# EAGLE design d_main2 (EAGLE 7.2.0)
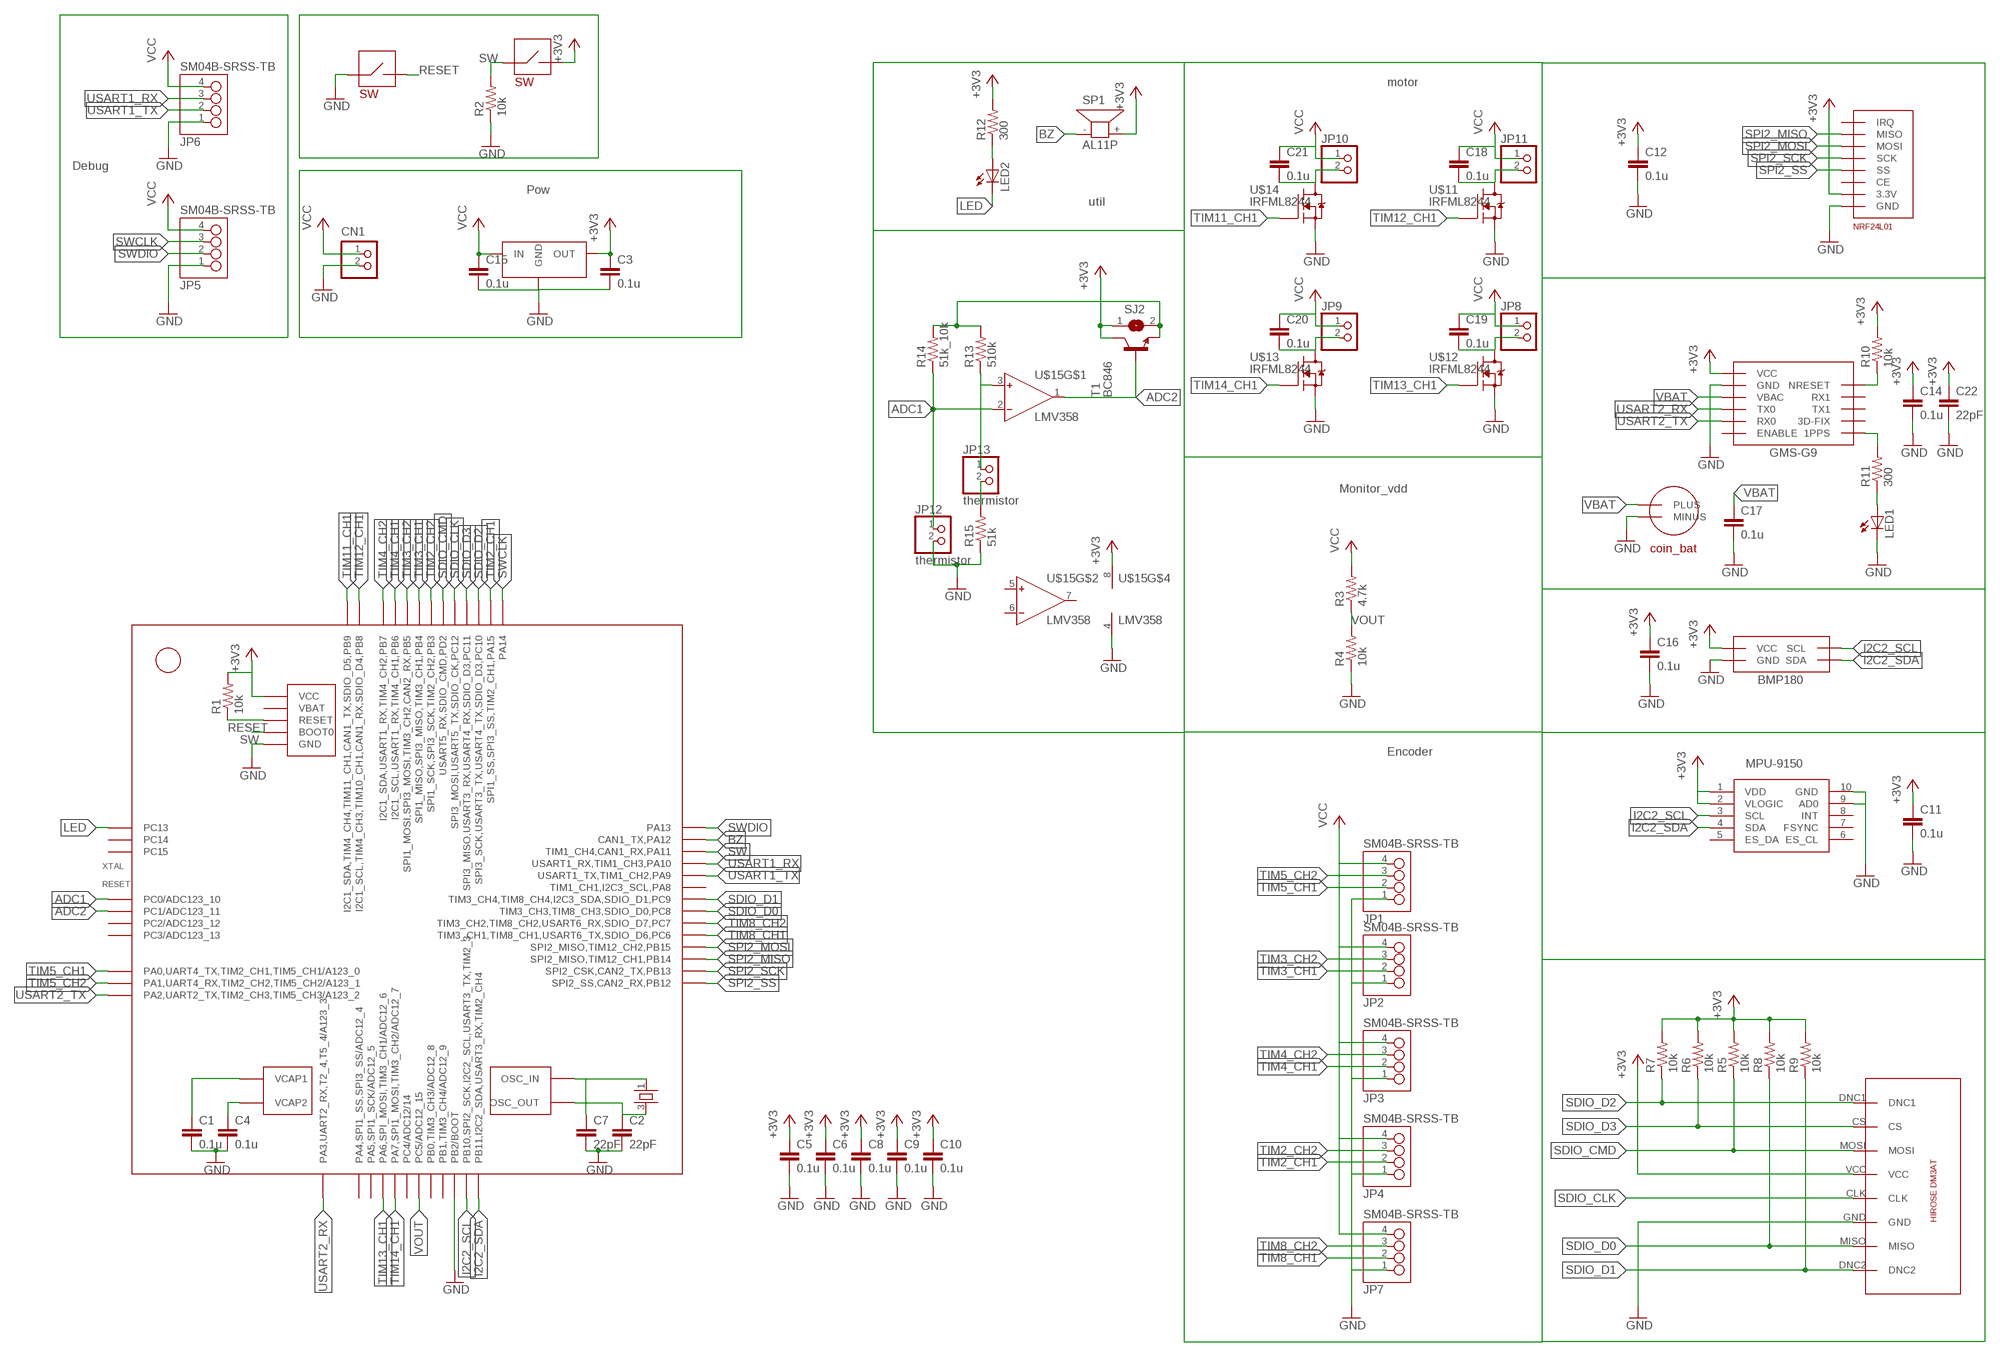
[diagram p0: schematic, sheet 1, part 1 of 2]
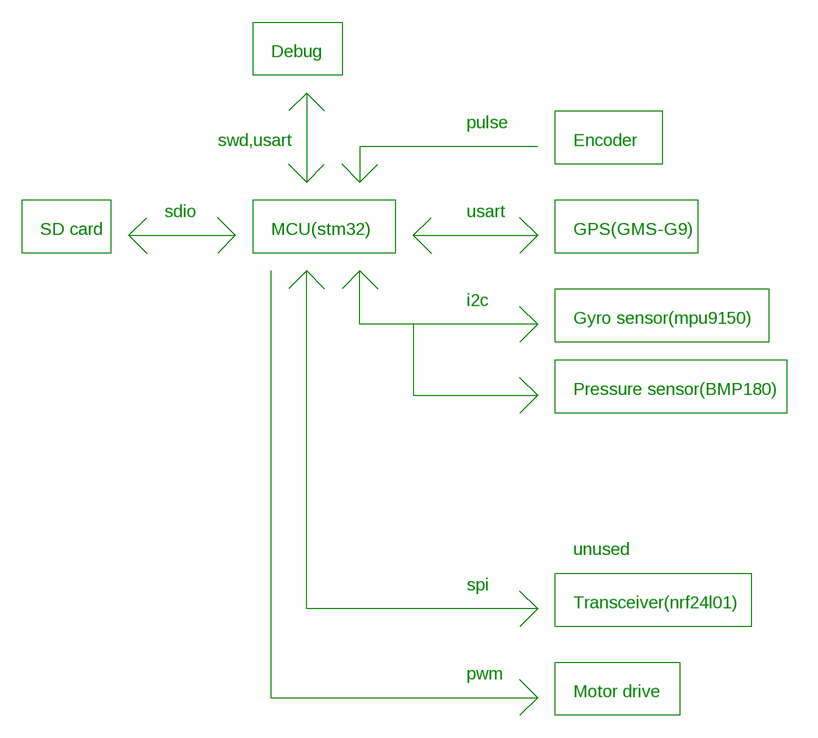
[diagram p1: schematic, sheet 1, part 2 of 2]

## Parts
C1  0.1u  C-EUC0603K  [C0603K]
C2  22pF  C-EUC0603K  [C0603K]
C3  0.1u  C-EUC0603K  [C0603K]
C4  0.1u  C-EUC0603K  [C0603K]
C5  0.1u  C-EUC0603K  [C0603K]
C6  0.1u  C-EUC0603K  [C0603K]
C7  22pF  C-EUC0603K  [C0603K]
C8  0.1u  C-EUC0603K  [C0603K]
C9  0.1u  C-EUC0603K  [C0603K]
C10  0.1u  C-EUC0603K  [C0603K]
C11  0.1u  C-EUC0603K  [C0603K]
C12  0.1u  C-EUC0603K  [C0603K]
C14  0.1u  C-EUC0603K  [C0603K]
C15  0.1u  C-EUC0603K  [C0603K]
C16  0.1u  C-EUC0603K  [C0603K]
C17  0.1u  C-EUC0603K  [C0603K]
C18  0.1u  C-EUC0603K  [C0603K]
C19  0.1u  C-EUC0603K  [C0603K]
C20  0.1u  C-EUC0603K  [C0603K]
C21  0.1u  C-EUC0603K  [C0603K]
C22  22pF  C-EUC0603K  [C0603K]
CN1  S2B-XASK-1  [S2B-XASK-1]
JP1  SM04B-SRSS-TB  [SM04B-SRSS-TB]
JP2  SM04B-SRSS-TB  [SM04B-SRSS-TB]
JP3  SM04B-SRSS-TB  [SM04B-SRSS-TB]
JP4  SM04B-SRSS-TB  [SM04B-SRSS-TB]
JP5  SM04B-SRSS-TB  [SM04B-SRSS-TB]
JP6  SM04B-SRSS-TB  [SM04B-SRSS-TB]
JP7  SM04B-SRSS-TB  [SM04B-SRSS-TB]
JP8  PINHD-1X2  [1X02]
JP9  PINHD-1X2  [1X02]
JP10  PINHD-1X2  [1X02]
JP11  PINHD-1X2  [1X02]
JP12  thermistor  PINHD-1X2  [1X02]
JP13  thermistor  PINHD-1X2  [1X02]
LED1  LEDCHIP-LED0603  [CHIP-LED0603]
LED2  LEDCHIP-LED0603  [CHIP-LED0603]
R1  10k  R-US_R0603  [R0603]
R2  10k  R-US_R0603  [R0603]
R3  4.7k  R-US_R0603  [R0603]
R4  10k  R-US_R0603  [R0603]
R5  10k  R-US_R0603  [R0603]
R6  10k  R-US_R0603  [R0603]
R7  10k  R-US_R0603  [R0603]
R8  10k  R-US_R0603  [R0603]
R9  10k  R-US_R0603  [R0603]
R10  10k  R-US_R0603  [R0603]
R11  300  R-US_R0603  [R0603]
R12  300  R-US_R0603  [R0603]
R13  510k  R-US_R0603  [R0603]
R14  51k_10k  R-US_R0603  [R0603]
R15  51k  R-US_R0603  [R0603]
SJ2  SJ  [SJ]
SP1  AL11P  [AL11P]
STM32F405RGT6  STM32F405_T  [LQFP64]
T1  BC846  [SOT23]
U$1  GMS-G9  [GMS-G9]
U$2  BMP180  [BMP180]
U$3  NRF24L01  [NRF24L01]
U$4  1056TR  [1056TR]
U$5  DM3AT  [DM3AT]
U$6  SWTVBP06-B043CB-B  [SW]
U$7  SWTVBP06-B043CB-B  [SW]
U$8  AP7361-33E  [SOT223]
U$9  25MHz  ASF_T  [ASF]
U$10  MPU-9150  [MPU-9150]
U$11  IRFML8244  [SOT23]
U$12  IRFML8244  [SOT23]
U$13  IRFML8244  [SOT23]
U$14  IRFML8244  [SOT23]
U$15  LMV358  [SO8]

## Nets
+3V3: C3.1 C5.1 C6.1 C8.1 C9.1 C10.1 C11.1 C12.1 C14.1 C16.1 C22.1 R1.2 R5.2 R6.2 R7.2 R8.2 R9.2 R10.2 R12.2 SJ2.1 SP1.+ STM32F405RGT6.13(VCC) STM32F405RGT6.19(VCC) STM32F405RGT6.32(VCC) STM32F405RGT6.48(VCC) STM32F405RGT6.64(VCC) T1.3(C) U$1.VCC U$2.VDD(VCC) U$2.VDDIO(VCC) U$3.3.3V U$5.VCC U$7.P$2 U$8.OUT U$10.1(VDD) U$10.2(VLOGIC) U$15.8(V+)
ADC1: JP12.1 R14.1 STM32F405RGT6.8(PC0/ADC123_10) U$15.2(IN-)
ADC2: STM32F405RGT6.9(PC1/ADC123_11) T1.1(B) U$15.1(OUT)
BZ: SP1.- STM32F405RGT6.45(CAN1_TX,PA12)
GND: C1.2 C2.2 C3.2 C4.2 C5.2 C6.2 C7.2 C8.2 C9.2 C10.2 C11.2 C12.2 C14.2 C15.2 C16.2 C17.2 C22.2 CN1.2 JP1.1 JP2.1 JP3.1 JP4.1 JP5.1 JP6.1 JP7.1 JP12.2 LED1.C R2.1 R4.1 R15.1 STM32F405RGT6.12(GND) STM32F405RGT6.18(GND) STM32F405RGT6.28(PB2/BOOT) STM32F405RGT6.63(GND) U$1.GND U$1.GND1(GND) U$2.GND U$3.GND U$4.MINUS U$5.GND U$6.P$1 U$8.GND1(GND) U$8.GND2(GND) U$10.9(AD0) U$10.10(GND) U$11.2(S) U$12.2(S) U$13.2(S) U$14.2(S) U$15.4(V-)
I2C2_SCL: STM32F405RGT6.29(PB10,SPI2_SCK,I2C2_SCL,USART3_TX,TIM2_3) U$2.SCL U$10.3(SCL)
I2C2_SDA: STM32F405RGT6.30(PB11,I2C2_SDA,USART3_RX,TIM2_CH4) U$2.SDA U$10.4(SDA)
LED: LED2.C STM32F405RGT6.2(PC13)
N$5: C4.1 STM32F405RGT6.47(VCAP2)
N$6: C1.1 STM32F405RGT6.31(VCAP1)
N$7: C7.1 STM32F405RGT6.5(OSC_IN) U$9.1
N$8: C2.1 STM32F405RGT6.6(OSC_OUT) U$9.3
N$10: R10.1 U$1.NRESET
N$11: R11.2 U$1.1PPS
N$12: LED1.A R11.1
N$16: LED2.A R12.1
N$17: C18.2 JP11.2 U$11.3(D)
N$18: C19.2 JP8.2 U$12.3(D)
N$19: C20.2 JP9.2 U$13.3(D)
N$20: C21.2 JP10.2 U$14.3(D)
N$23: JP13.1 R13.1 U$15.3(IN+)
N$25: R13.2 R14.2 SJ2.2 T1.2(E)
N$26: JP13.2 R15.2
RESET: R1.1 STM32F405RGT6.7(RESET) U$6.P$2
SDIO_CLK: STM32F405RGT6.53(SPI3_MOSI,USART5_TX,SDIO_CK,PC12) U$5.CLK
SDIO_CMD: R5.1 STM32F405RGT6.54(USART5_RX,SDIO_CMD,PD2) U$5.MOSI
SDIO_D0: R8.1 STM32F405RGT6.39(TIM3_CH3,TIM8_CH3,SDIO_D0,PC8) U$5.MISO
SDIO_D1: R9.1 STM32F405RGT6.40(TIM3_CH4,TIM8_CH4,I2C3_SDA,SDIO_D1,PC9) U$5.DNC2
SDIO_D2: R7.1 STM32F405RGT6.51(SPI3_SCK,USART3_TX,USART4_TX,SDIO_D3,PC10) U$5.DNC1
SDIO_D3: R6.1 STM32F405RGT6.52(SPI3_MISO,USART3_RX,USART4_RX,SDIO_D3,PC11) U$5.CS
SPI2_MISO: STM32F405RGT6.35(SPI2_MISO,TIM12_CH1,PB14) U$3.MISO
SPI2_MOSI: STM32F405RGT6.36(SPI2_MISO,TIM12_CH2,PB15) U$3.MOSI
SPI2_SCK: STM32F405RGT6.34(SPI2_CSK,CAN2_TX,PB13) U$3.SCK
SPI2_SS: STM32F405RGT6.33(SPI2_SS,CAN2_RX,PB12) U$3.SS
SW: R2.2 STM32F405RGT6.44(TIM1_CH4,CAN1_RX,PA11) STM32F405RGT6.60(BOOT0) U$7.P$1
SWCLK: JP5.3 STM32F405RGT6.49(PA14)
SWDIO: JP5.2 STM32F405RGT6.46(PA13)
TIM2_CH1: JP4.2 STM32F405RGT6.50(SPI1_SS,SPI3_SS,TIM2_CH1,PA15)
TIM2_CH2: JP4.3 STM32F405RGT6.55(SPI1_SCK,SPI3_SCK,TIM2_CH2,PB3)
TIM3_CH1: JP2.2 STM32F405RGT6.56(SPI1_MISO,SPI3_MISO,TIM3_CH1,PB4)
TIM3_CH2: JP2.3 STM32F405RGT6.57(SPI1_MOSI,SPI3_MOSI,TIM3_CH2,CAN2_RX,PB5)
TIM4_CH1: JP3.2 STM32F405RGT6.58(I2C1_SCL,USART1_RX,TIM4_CH1,PB6)
TIM4_CH2: JP3.3 STM32F405RGT6.59(I2C1_SDA,USART1_RX,TIM4_CH2,PB7)
TIM5_CH1: JP1.2 STM32F405RGT6.14(PA0,UART4_TX,TIM2_CH1,TIM5_CH1/A123_0)
TIM5_CH2: JP1.3 STM32F405RGT6.15(PA1,UART4_RX,TIM2_CH2,TIM5_CH2/A123_1)
TIM8_CH1: JP7.2 STM32F405RGT6.37(TIM3_CH1,TIM8_CH1,USART6_TX,SDIO_D6,PC6)
TIM8_CH2: JP7.3 STM32F405RGT6.38(TIM3_CH2,TIM8_CH2,USART6_RX,SDIO_D7,PC7)
TIM11_CH1: STM32F405RGT6.62(I2C1_SDA,TIM4_CH4,TIM11_CH1,CAN1_TX,SDIO_D5,PB9) U$14.1(G)
TIM12_CH1: STM32F405RGT6.61(I2C1_SCL,TIM4_CH3,TIM10_CH1,CAN1_RX,SDIO_D4,PB8) U$11.1(G)
TIM13_CH1: STM32F405RGT6.22(PA6,SPI_MOSI,TIM3_CH1/ADC12_6) U$12.1(G)
TIM14_CH1: STM32F405RGT6.23(PA7,SPI1_MOSI,TIM3_CH2/ADC12_7) U$13.1(G)
USART1_RX: JP6.3 STM32F405RGT6.43(USART1_RX,TIM1_CH3,PA10)
USART1_TX: JP6.2 STM32F405RGT6.42(USART1_TX,TIM1_CH2,PA9)
USART2_RX: STM32F405RGT6.17(PA3,UART2_RX,T2_4,T5_4/A123_3) U$1.TX0
USART2_TX: STM32F405RGT6.16(PA2,UART2_TX,TIM2_CH3,TIM5_CH3/A123_2) U$1.RX0
VBAT: C17.1 U$1.VBAC U$4.PLUS
VCC: C15.1 C18.1 C19.1 C20.1 C21.1 CN1.1 JP1.4 JP2.4 JP3.4 JP4.4 JP5.4 JP6.4 JP7.4 JP8.1 JP9.1 JP10.1 JP11.1 R3.2 U$8.IN
VOUT: R3.1 R4.2 STM32F405RGT6.25(PC5/ADC12_15)
Unconnected: STM32F405RGT6.1(VBAT) STM32F405RGT6.3(PC14) STM32F405RGT6.4(PC15) STM32F405RGT6.10(PC2/ADC123_12) STM32F405RGT6.11(PC3/ADC123_13) STM32F405RGT6.20(PA4,SPI1_SS,SPI3_SS/ADC12_4) STM32F405RGT6.21(PA5,SPI1_SCK/ADC12_5) STM32F405RGT6.24(PC4/ADC12/14) STM32F405RGT6.26(PB0,TIM3_CH3/ADC12_8) STM32F405RGT6.27(PB1,TIM3_CH4/ADC12_9) STM32F405RGT6.41(TIM1_CH1,I2C3_SCL,PA8) U$1.3D-FIX U$1.ENABLE U$1.RX1 U$1.TX1 U$3.CE U$3.IRQ U$10.5(ES_DA) U$10.6(ES_CL) U$10.7(FSYNC) U$10.8(INT) U$15.5(IN+) U$15.6(IN-) U$15.7(OUT)

## Notes on the sheet
- motor
- Debug
- Debug
- Pow
- util | pulse
- swd,usart | Encoder
- sdio | usart
- SD card | MCU(stm32) | GPS(GMS-G9)
- i2c
- Gyro sensor(mpu9150)
- Pressure sensor(BMP180)
- Monitor_vdd | unused
- spi
- Transceiver(nrf24l01)
- pwm
- Motor drive
- Encoder

## Library data of the parts
C1-C12 C14-C22 = resistor:C-EU: CAPACITOR, European symbol
CN1 = jst-xa:S2B-XASK-1: Wire-to-Board 2.5mm pitch top mount connector Source: http://www.jst-mfg.com/product/pdf/jpn/XA1.pdf http://www.jst-mfg.com/product/detail.php?series=272
JP1-JP7 = con-jst-sh:SM04B-SRSS-TB
JP8-JP13 = pinhead:PINHD-1X2: PIN HEADER
LED1 LED2 = led:LED: LED OSRAM: - CHIPLED LG R971, LG N971, LY N971, LG Q971, LY Q971, LO R971, LY R971 LH N974, LH R974 LS Q976, LO Q976, LY Q976 LO Q996 - Hyper CHIPLED LW Q18S LB Q993, LB Q99A, LB R99A - SideLED LS A670, LO A670, LY A670, LG A670, LP A670 LB A673, LV A673, LT A673, LW A673 LH A674 LY A675 LS A676, LA A676, LO A676, LY A676, LW A676 LS A679, LY A679, LG A679 - Hyper Micro SIDELED® LS Y876, LA Y876, LO Y876, LY Y876 LT Y87S - SmartLED LW L88C, LW L88S LB L89C, LB L89S, LG L890 LS L89K, LO L89K, LY L89K LS L896, LA L896, LO L896, LY L896 - TOPLED LS T670, LO T670, LY T670, LG T670, LP T670 LSG T670, LSP T670, LSY T670, LOP T670, LYG T670 LG T671, LOG T671, LSG T671 LB T673, LV T673, LT T673, LW T673 LH T674 LS T676, LA T676, LO T676, LY T676, LB T676, LH T676, LSB T676, LW T676 LB T67C, LV T67C, LT T67C, LS T67K, LO T67K, LY T67K, LW E67C LS E67B, LA E67B, LO E67B, LY E67B, LB E67C, LV E67C, LT E67C LW T67C LS T679, LY T679, LG T679 LS T770, LO T770, LY T770, LG T770, LP T770 LB T773, LV T773, LT T773, LW T773 LH T774 LS E675, LA E675, LY E675, LS T675 LS T776, LA T776, LO T776, LY T776, LB T776 LHGB T686 LT T68C, LB T68C - Hyper Mini TOPLED® LB M676 - Mini TOPLED Santana® LG M470 LS M47K, LO M47K, LY M47K Source: http://www.osram.convergy.de LUXEON: - LUMILED® LXK2-PW12-R00, LXK2-PW12-S00, LXK2-PW14-U00, LXK2-PW14-V00 LXK2-PM12-R00, LXK2-PM12-S00, LXK2-PM14-U00 LXK2-PE12-Q00, LXK2-PE12-R00, LXK2-PE12-S00, LXK2-PE14-T00, LXK2-PE14-U00 LXK2-PB12-K00, LXK2-PB12-L00, LXK2-PB12-M00, LXK2-PB14-N00, LXK2-PB14-P00, LXK2-PB14-Q00 LXK2-PR12-L00, LXK2-PR12-M00, LXK2-PR14-Q00, LXK2-PR14-R00 LXK2-PD12-Q00, LXK2-PD12-R00, LXK2-PD12-S00 LXK2-PH12-R00, LXK2-PH12-S00 LXK2-PL12-P00, LXK2-PL12-Q00, LXK2-PL12-R00 Source: www.luxeon.com KINGBRIGHT: KA-3528ASYC Source: www.kingbright.com
R1-R15 = resistor:R-US_: RESISTOR, American symbol
SJ2 = jumper:SJ: SMD solder JUMPER
SP1 = buzzer:AL11P: SPEAKER Source: Buerklin; OC_FARNELL: unknown; OC_NEWARK: unknown
STM32F405RGT6 = stm32f:STM32F405_T
T1 = transistor-neu-to92:BC846: NPN TRANSISTOR
U$1 = GMS-G9:GMS-G9
U$2 = BMP180:BMP180
U$3 = T-NRF24L01:NRF24L01
U$4 = 1056TR:1056TR
U$5 = HIROSE-DM3AT:DM3AT
U$6 U$7 = TVBP06-B043CB-B:SW
U$8 = AP7361-33E:AP7361-33E
U$9 = crystal:ASF_T
U$10 = MPU-9150:MPU-9150
U$11-U$14 = transistor-fet:IRFML8244
U$15 = LMV358:LMV358

## Board
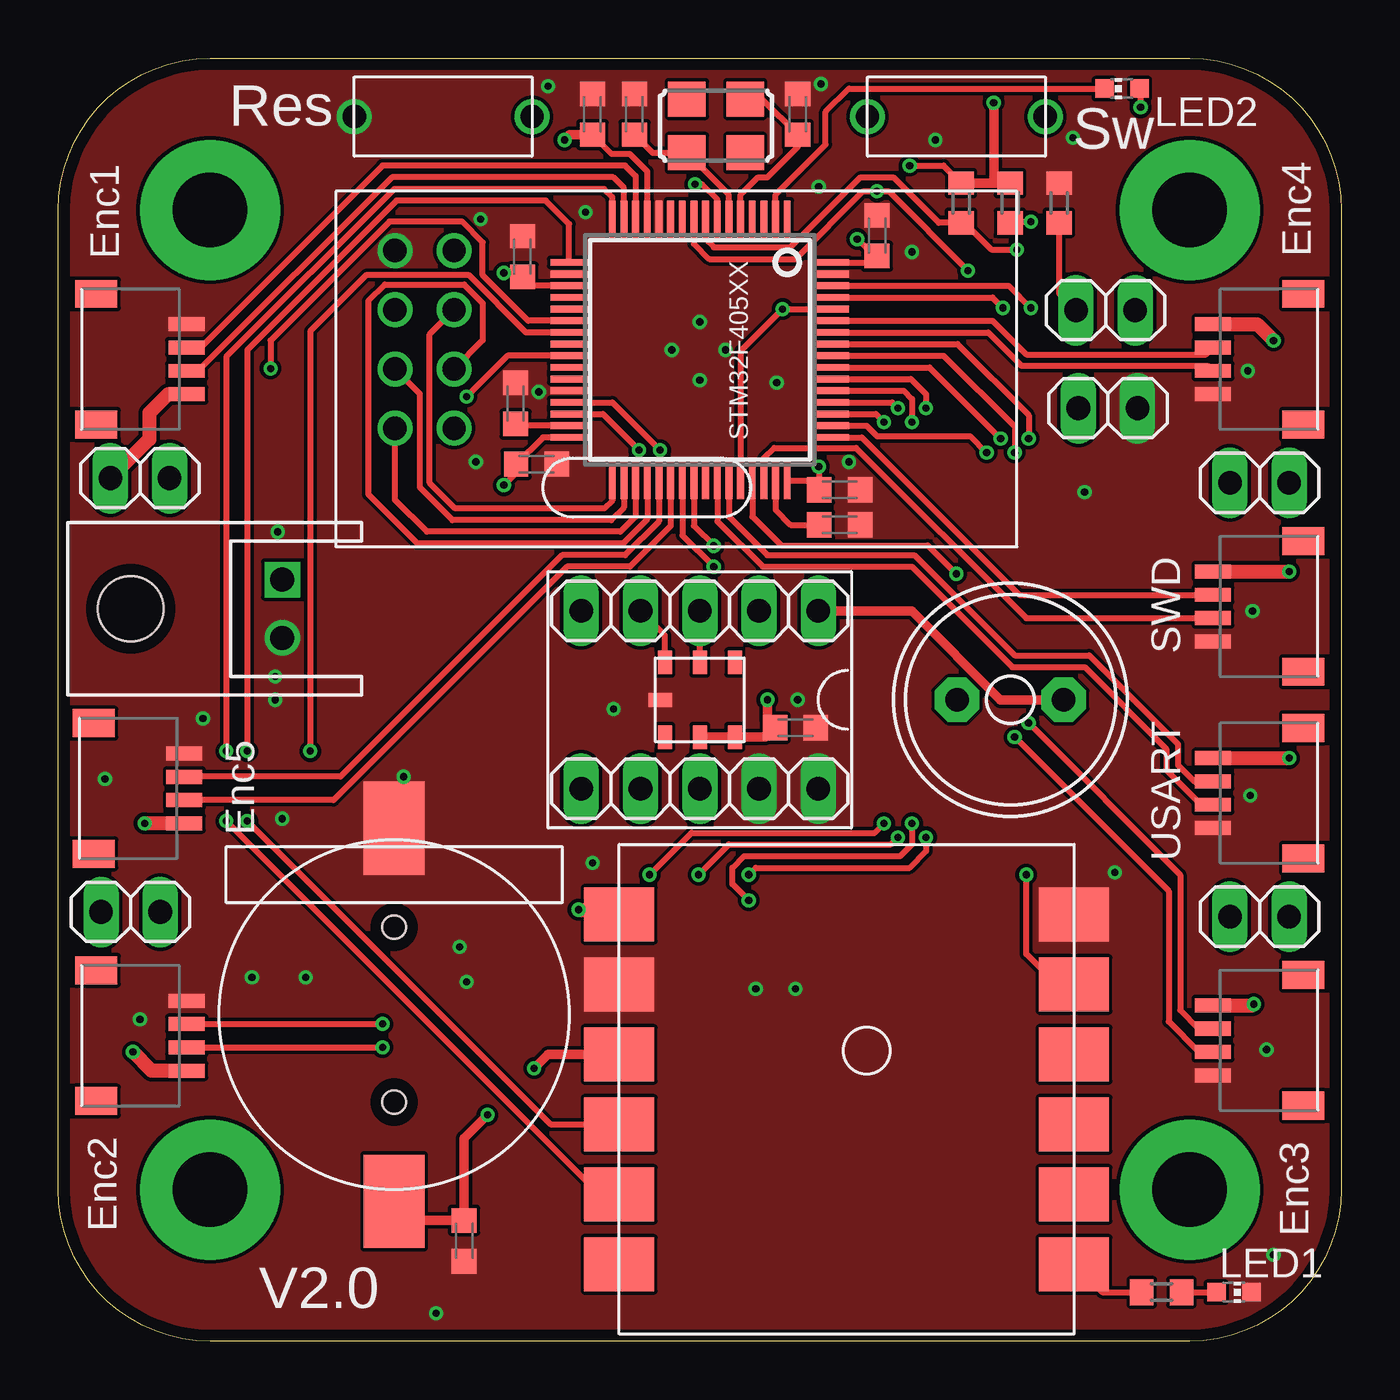
[diagram p2: board, top side]
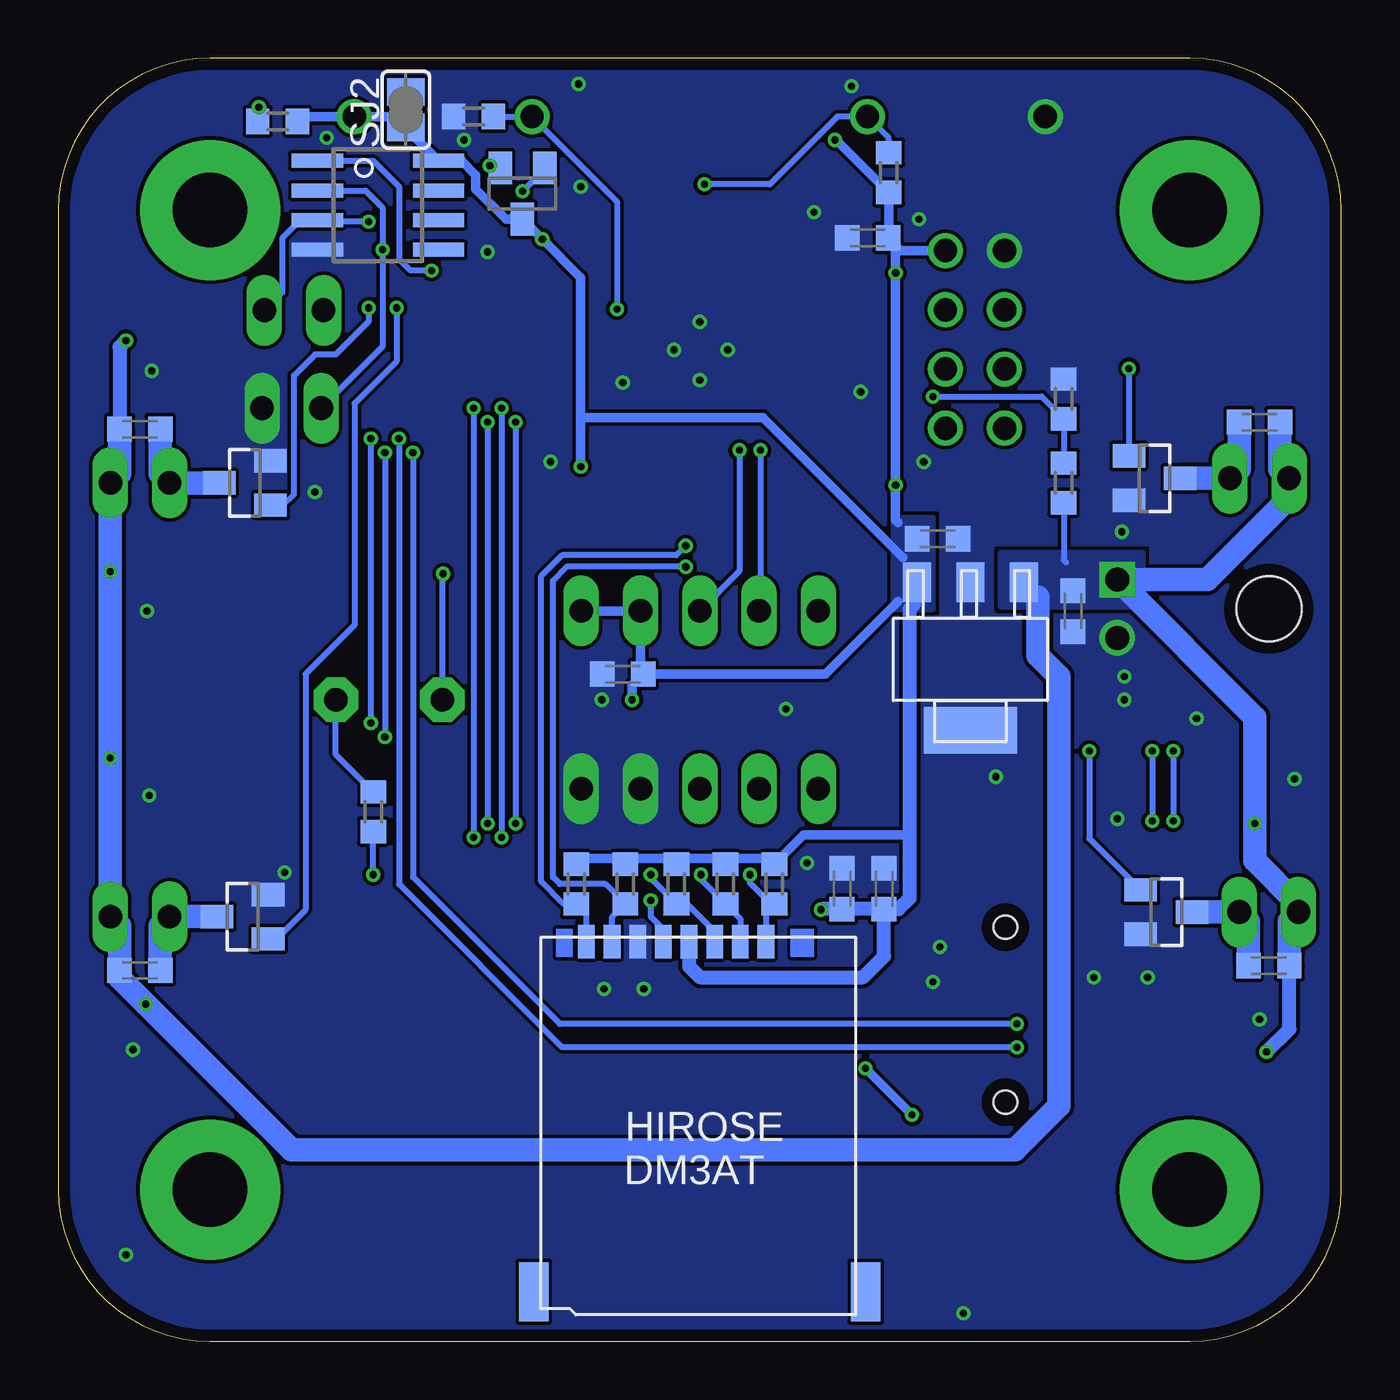
[diagram p3: board, bottom side, seen from below]

Size 55 x 55 mm. Coordinates in mm from the lower left corner, seen from the top.
Outline: 6.5,0 arc-90 0,6.5 0,48.5 arc-90 6.5,55 48.5,55 arc-90 55,48.5 55,6.5 arc-90 48.5,0 6.5,0
Copper layers (1*16): Top 0.035mm / dielectric 1.6mm / Bottom 0.035mm
Design rules "Elecrow_2-layer_PCB_eagle_rule": minimum track width 6mil, minimum drill 12mil, track to track 6mil, track to pad 6mil, pad to pad 6mil, via to via 8mil, smd to smd 0mil, copper to edge 20mil, drill to drill 10mil, minimum pad ring 6mil, minimum via ring 6mil, stop-mask expansion 0mil, vias tented up to drill 100mil, thermal gap 10mil

### Footprints (pad centres in the part's own frame; a part is rotated, then mirrored left to right if it is on the bottom)
C0603K = smd 1.05 x 1.08: 1 -0.875,0; 2 0.875,0
S2B-XASK-1 = drill 1.016 square: 1 1.25,0 | drill 1.016: 2 -1.25,0 | hole 2.8: 0,6.5
SM04B-SRSS-TB = smd 0.6 x 1.55: 1 -1.5,0; 2 -0.5,0; 3 0.5,0; 4 1.5,0 | smd 1.2 x 1.8: P-MOUNT1 -2.8,-3.875; P-MOUNT2 2.8,-3.875
1X02 = drill 1.016 long: 1 -1.27,0; 2 1.27,0
CHIP-LED0603 = smd 0.8 x 0.8: A 0,-0.75; C 0,0.75
R0603 = smd 1 x 1.1: 1 -0.85,0; 2 0.85,0
SJ = smd 1.168 x 1.6: 1 -0.762,0; 2 0.762,0
AL11P = drill 1.016 pad 1.905 octagon: + 2.286,0; - -2.286,0
LQFP64 = smd 1.6 x 0.3: 1 -5.6,3.75; 2 -5.6,3.25; 3 -5.6,2.75; 4 -5.6,2.25; 5 -5.6,1.75; 6 -5.6,1.25; 7 -5.6,0.75; 8 -5.6,0.25; 9 -5.6,-0.25; 10 -5.6,-0.75; 11 -5.6,-1.25; 12 -5.6,-1.75; 13 -5.6,-2.25; 14 -5.6,-2.75; 15 -5.6,-3.25; 16 -5.6,-3.75; 33 5.6,-3.75; 34 5.6,-3.25; 35 5.6,-2.75; 36 5.6,-2.25; 37 5.6,-1.75; 38 5.6,-1.25; 39 5.6,-0.75; 40 5.6,-0.25; 41 5.6,0.25; 42 5.6,0.75; 43 5.6,1.25; 44 5.6,1.75; 45 5.6,2.25; 46 5.6,2.75; 47 5.6,3.25; 48 5.6,3.75 | smd 0.3 x 1.6: 17 -3.75,-5.6; 18 -3.25,-5.6; 19 -2.75,-5.6; 20 -2.25,-5.6; 21 -1.75,-5.6; 22 -1.25,-5.6; 23 -0.75,-5.6; 24 -0.25,-5.6; 25 0.25,-5.6; 26 0.75,-5.6; 27 1.25,-5.6; 28 1.75,-5.6; 29 2.25,-5.6; 30 2.75,-5.6; 31 3.25,-5.6; 32 3.75,-5.6; 49 3.75,5.6; 50 3.25,5.6; 51 2.75,5.6; 52 2.25,5.6; 53 1.75,5.6; 54 1.25,5.6; 55 0.75,5.6; 56 0.25,5.6; 57 -0.25,5.6; 58 -0.75,5.6; 59 -1.25,5.6; 60 -1.75,5.6; 61 -2.25,5.6; 62 -2.75,5.6; 63 -3.25,5.6; 64 -3.75,5.6
SOT23 = smd 1 x 1.4: 1 -0.95,-1.1; 2 0.95,-1.1; 3 0,1.1
GMS-G9 = smd 3 x 2.3: 1PPS 9.75,-6; 3D-FIX 9.75,-3; ENABLE -9.75,-6; GND -9.75,6; GND1 9.75,9; NRESET 9.75,6; RX0 -9.75,-3; RX1 9.75,3; TX0 -9.75,0; TX1 9.75,0; VBAC -9.75,3; VCC -9.75,9
BMP180 = smd 1 x 0.6: GND 1.7,0 | smd 0.6 x 1: SCB 1.5,1.6; SCL 0,-1.6; SDA 1.5,-1.6; SDO -1.5,-1.6; VDD 0,1.6; VDDIO -1.5,1.6
NRF24L01 = drill 1: 3.3V 24.13,2.54; CE 26.67,5.08; GND 26.67,2.54; IRQ 24.13,10.16; MISO 26.67,10.16; MOSI 24.13,7.62; SCK 26.67,7.62; SS 24.13,5.08
1056TR = smd 4 x 2.6: MINUS 8,0; PLUS -8,0 | hole 1: -3.75,0; 3.75,0
DM3AT = smd 0.711 x 1.422: CLK -1.56,6.63; CS 1.74,6.63; DNC1 2.84,6.63; DNC2 -4.86,6.63; GND -2.66,6.63; MISO -3.76,6.63; MOSI 0.64,6.63; VCC -0.46,6.63 | smd 1.27 x 2.54: P$1 7.112,-8.382; P$2 -7.112,-8.382
SW = drill 1: P$1 -3.81,0; P$2 3.81,0
SOT223 = smd 4 x 2: GND1 0,3.81 | smd 1.2 x 1.7: GND2 0,-2.54; IN -2.3,-2.54; OUT 2.3,-2.54
ASF = smd 1.6 x 1.5: 1 -1.25,-1.15; 2 1.25,-1.15; 3 1.25,1.15; 4 -1.25,1.15
MPU-9150 = drill 1.016 long: 1 -3.81,5.08; 2 -3.81,2.54; 3 -3.81,0; 4 -3.81,-2.54; 5 -3.81,-5.08; 6 3.81,-5.08; 7 3.81,-2.54; 8 3.81,0; 9 3.81,2.54; 10 3.81,5.08
SO8 = smd 0.6 x 2.2: 1 -1.905,-2.6; 2 -0.635,-2.6; 3 0.635,-2.6; 4 1.905,-2.6; 5 1.905,2.6; 6 0.635,2.6; 7 -0.635,2.6; 8 -1.905,2.6

### Placement (x,y rotation side)
C1  19.6,40.2 90 top
C2  24.7,52.6 90 top
C3  17.3,34.4 0 bottom
C4  33.5,35 0 top
C5  19.9,46.5 90 top
C6  22.9,52.6 90 top
C7  31.7,52.6 90 top
C8  20.5,37.6 0 top
C9  33.5,36.5 0 top
C10  35.1,47.4 90 top
C11  30.8,28.6 180 bottom
C12  20.3,47.3 180 bottom
C14  19.6,19.4 90 bottom
C15  11.5,31.3 270 bottom
C16  31.6,26.3 0 top
C17  17.4,4.3 270 top
C18  51.5,15.9 0 bottom
C19  3.5,39.4 180 bottom
C20  3.1,16.1 180 bottom
C21  51.5,39.1 0 bottom
C22  21.4,19.4 90 bottom
CN1  9.6,31.4 90 top
JP1  5.5,42.1 270 top
JP2  49.5,12.9 90 top
JP3  49.5,42.1 90 top
JP4  5.5,13.1 270 top
JP5  49.5,31.5 90 top
JP6  49.5,23.5 90 top
JP7  5.4,23.7 270 top
JP8  3.5,37 0 top
JP9  3.1,18.4 0 top
JP10  51.5,36.8 180 top
JP11  51.5,18.2 180 top
JP12  45,40 0 top
JP13  44.9,44.2 180 top
LED1  50.4,2.1 270 top
LED2  45.6,53.7 90 top
R1  19.4,50.1 270 bottom
R2  37.2,52.5 0 bottom
R3  11.9,36.8 270 bottom
R4  11.9,40.4 270 bottom
R5  28.5,19.6 90 bottom
R6  26.4,19.6 90 bottom
R7  24.3,19.6 90 bottom
R8  30.7,19.6 90 bottom
R9  32.8,19.6 90 bottom
R10  41.5,22.7 90 bottom
R11  47.3,2.1 180 top
R12  45.6,52.3 0 bottom
R13  40.8,48.8 90 top
R14  38.7,48.8 90 top
R15  42.9,48.8 270 top
SJ2  40.1,52.8 90 bottom
SP1  40.82,27.5 0 top
STM32F405RGT6  27.5,42.5 270 top
T1  35.1,49.2 180 bottom
U$1  33.8,9.3 0 top
U$2  27.5,27.5 180 top
U$3  41.1,49.3 180 top
U$4  14.4,14 90 top
U$5  27.5,10.5 0 bottom
U$6  16.5,52.5 0 top
U$7  38.5,52.5 0 top
U$8  15.9,30 180 bottom
U$9  28.2,52.1 180 top
U$10  27.5,27.5 270 top
U$11  47.1,18.2 90 bottom
U$12  8,37 270 bottom
U$13  7.5,18.4 270 bottom
U$14  47,36.8 90 bottom
U$15  41.3,48.7 270 bottom

### Tracks (layer width: path | path; a pad name or v marks a point on that pad's centre or on a via)
+3V3  (via drill 0.3)
  Top 0.254: STM32F405RGT6.19 20.27,45.25 C5.1 19.73,45.8 v19.1,45.8 | STM32F405RGT6.13 25.25,50.15 24.5,50.9 23.73,50.9 C6.1 | v19.1,36.7 19.62,37.23 C8.1 20.77,38.75 STM32F405RGT6.32 | v32.6,37.5 32.6,36.52 C9.1 32.23,36.9 STM32F405RGT6.48 | v34.25,47.25 34.98,46.52 C10.1 34.83,46.25 STM32F405RGT6.64
  Top 0.406: v21.7,51.5 21.93,51.73 C6.1 | v30.4,27.5 30.4,26.62 C16.1 30.33,25.9 U$2.VDDIO U$2.VDD | SP1.+ 40.4,27.5 36.59,31.31 U$10.1
  Top 0.61: v22.3,18.5 23.85,18.5 U$1.VCC
  Bottom 0.254: R10.2 43.11,25.16 SP1.+
  Bottom 0.406: 19,35.1 19.1,35.2 v19.1,36.7 v19.1,45.8 19.1,46.98 C12.1 | 18.5,21.7 23.05,21.7 R7.2 24.55,20.7 26.4,20.7 | 26.4,20.7 28.4,20.7 | 28.4,20.7 30.8,20.7 | 30.8,20.7 32.55,20.7 R9.2 | R6.2 26.4,20.7 | R5.2 28.5,20.6 28.4,20.7 | R8.2 30.7,20.6 30.8,20.7 | C12.1 19.4,47.33 R1.2 21.65,51.5 v21.7,51.5 | U$3.3.3V 18.89,46.76 C12.1 | C11.1 22.1,28.6 19,31.7 | C11.1 30.04,28.71 U$10.2 U$10.1 | C11.1 30.4,28.12 v30.4,27.5 | R12.2 44.55,52.5 U$7.P$2 40.56,52.5 SJ2.1 40.1,52.01 U$15.8 37.7,50.6 37.1,50 37.1,49.4 35.8,48.1 T1.3 v34.25,47.25 32.6,45.6 32.6,39.6 | 32.6,39.6 v32.6,37.5 | 32.6,39.6 24.8,39.6 18.8,33.6
  Bottom 0.61: C14.1 18.98,18.52 18.5,19 18.5,21.7 18.5,31.4 18.3,31.6 | v22.3,18.5 22.27,18.52 C22.1 C14.1 | U$5.VCC 27.96,16.06 27.5,15.6 20.5,15.6 19.6,16.5 C14.1
  pour Bottom (no thermals): 17.5,35.3 19.2,35.3 19.2,31.4 17.5,31.4
ADC1  (via drill 0.3)
  Top 0.254: v41.1,46.8 40,46.8 38.85,47.95 R14.1 37.75,47.95 35.8,49.9 34.4,49.9 31.4,46.9 28.1,46.9 27.75,47.25 STM32F405RGT6.8
  Bottom 0.254: U$15.2 41.84,49.34 41.1,48.6 v41.1,46.8 41.1,42.63 JP12.1
ADC2  (via drill 0.3)
  Top 0.254: v39,45.9 35.6,49.3 v35.1,49.3 34.5,49.3 31.6,46.4 27.9,46.4 27.25,47.05 STM32F405RGT6.9
  Bottom 0.254: U$15.1 41.51,50.6 40.4,49.5 40.4,46.4 39.9,45.9 v39,45.9 | v35.1,49.3 34.15,50.25 T1.1
BZ  (via drill 0.3)
  Top 0.254: STM32F405RGT6.45 29.75,35.35 29.77,35.35 31,34.12 37.28,34.12 v38.5,32.9
  Bottom 0.254: SP1.- 38.53,32.87 v38.5,32.9
GND  (via drill 0.3)
  other vias: 22.9,20.5 10.6,15.6 17.9,37.7 33.9,37.7 30.8,41.1 32.6,49.5 36.6,46.7 21,53.8 32.7,53.9 27.5,43.7 26.3,42.5 27.5,41.2 28.6,42.5 22.6,48.4 18.1,48.1 20.6,40.7 37.6,51.5 43.5,51.6 51,41.6 51.2,31.3 51.1,23.4 51.8,12.5 45.3,20.1 44,36.4 29.9,15.1 31.6,15.1 17.2,16.9 17.5,15.4 16.2,1.2 14.8,24.2 8.3,15.6 3.5,13.8 2,24.1 9.3,28.5 9.3,27.5 6.2,26.7 9.6,22.4 9.4,34.7 31.7,27.5 23.8,27.1 52.1,3.7
  pour Bottom (rank 6, no thermals): -4.5,59.5 59.5,59.5 59.5,-4.5 -4.5,-4.5
  pour Top (rank 6, no thermals): -6.5,61.5 61.5,61.5 61.5,-6.5 -6.5,-6.5
I2C2_SCL  (via drill 0.3)
  Top 0.254: STM32F405RGT6.29 23.75,40.25 v25.8,38.2 | U$2.SCL U$10.3
  Bottom 0.254: v25.8,38.2 25.8,33.01 U$10.3
I2C2_SDA  (via drill 0.3)
  Top 0.254: STM32F405RGT6.30 23.35,39.75 v24.9,38.2 | U$2.SDA 26,30.27 U$10.4
  Bottom 0.254: v24.9,38.2 24.9,31.37 U$10.4
LED
  Top 0.254: STM32F405RGT6.2 30.75,49.15 32.9,51.3 32.9,52.7 33.9,53.7 LED2.C
N$1  (via drill 3.2 pad 6)
  other vias: 6.5,6.5
N$2  (via drill 3.2 pad 6)
  other vias: 6.5,48.5
N$3  (via drill 3.2 pad 6)
  other vias: 48.5,48.5
N$4  (via drill 3.2 pad 6)
  other vias: 48.5,6.5
N$5
  Top 0.254: STM32F405RGT6.47 30.75,35.65 31.4,35 C4.1
N$6
  Top 0.254: STM32F405RGT6.31 19.68,39.25 C1.1
N$7
  Top 0.254: U$9.1 30.17,53.25 C7.1 31.7,51.2 30.4,49.9 30,49.9 29.25,49.15 STM32F405RGT6.5
N$8
  Top 0.254: C2.1 25.48,50.95 U$9.3 28.75,49.15 STM32F405RGT6.6
N$10  (via drill 0.3)
  Top 0.254: v41.5,20 41.5,16.6 42.8,15.3 U$1.NRESET
  Bottom 0.254: v41.5,20 R10.1
N$11
  Top 0.254: U$1.1PPS 44.75,2.1 R11.2
N$12
  Top 0.254: R11.1 LED1.A
N$16  (via drill 0.3)
  Top 0.254: v46.4,52.9 46.4,53.65 LED2.A
  Bottom 0.254: R12.1 46.4,52.35 v46.4,52.9
N$17
  Bottom 1.016: C18.2 50.62,17.8 JP11.2 U$11.3
N$18
  Bottom 1.016: C19.2 4.38,37.4 JP8.2 U$12.3
N$19
  Bottom 1.016: C20.2 3.97,18 JP9.2 U$13.3
N$20
  Bottom 1.016: C21.2 50.62,37.2 JP10.2 U$14.3
N$23  (via drill 0.3)
  Top 0.254: R13.1 40.85,48 v41.7,48
  Bottom 0.254: v41.7,48 43.84,48 | 43.84,48 U$15.3 | 43.84,48 44.7,48 45.4,47.3 45.4,44.97 JP13.1
N$25  (via drill 0.3)
  Top 0.254: v36.5,50.4 37.95,50.4 R14.2
  Top 0.406: v40.1,53.1 40.1,49.75 40,49.65 | R14.2 40,49.65 | 40,49.65 R13.2
  Bottom 0.254: T1.2 36.15,50.4 v36.5,50.4
  Bottom 0.406: SJ2.2 v40.1,53.1
N$26
  Top 0.254: R15.2 42.9,44.93 JP13.2
RESET  (via drill 0.3)
  Top 0.254: STM32F405RGT6.7 28.25,48.95 27.6,49.6 v27.3,49.6
  Bottom 0.254: v27.3,49.6 24.5,49.6 21.6,52.5 U$6.P$2 19.4,51.59 R1.1
SDIO_CLK  (via drill 0.3)
  Top 0.254: v29.6,18.9 28.9,19.6 28.9,20.3 29.4,20.8 36.1,20.8 36.6,21.3 v36.6,22.2 | STM32F405RGT6.53 36.25,40.75 36.6,40.4 v36.6,39.4
  Bottom 0.254: v29.6,18.9 29.6,18.2 29.06,17.66 U$5.CLK | v36.6,39.4 v36.6,22.2
SDIO_CMD  (via drill 0.3)
  Top 0.254: v29.6,20 29.9,20.3 36.5,20.3 37.2,21 v37.2,21.6 | STM32F405RGT6.54 36.55,41.25 37.2,40.6 v37.2,40
  Bottom 0.254: U$5.MOSI 26.86,17.56 28.05,18.75 R5.1 29.6,19.85 v29.6,20 | v37.2,40 v37.2,21.6
SDIO_D0  (via drill 0.3)
  Top 0.254: STM32F405RGT6.39 26.75,34.55 v28.1,33.2
  Bottom 0.254: U$5.MISO 31.26,18.19 R8.1 31.55,19.6 33.5,19.6 33.8,19.9 33.8,32.6 33.2,33.2 v28.1,33.2
SDIO_D1  (via drill 0.3)
  Top 0.254: STM32F405RGT6.40 27.25,34.95 v28.1,34.1
  Bottom 0.254: U$5.DNC2 32.36,18.31 R9.1 33.35,18.75 34.3,19.7 34.3,32.8 33.4,33.7 28.5,33.7 v28.1,34.1
SDIO_D2  (via drill 0.3)
  Top 0.254: v25.35,20 27.15,21.8 35,21.8 v35.4,22.2 | STM32F405RGT6.51 35.05,39.75 v35.4,39.4
  Bottom 0.254: U$5.DNC1 24.66,18.39 R7.1 24.45,18.75 25.35,19.65 v25.35,20 | v35.4,39.4 v35.4,22.2
SDIO_D3  (via drill 0.3)
  Top 0.254: v27.45,20 28.75,21.3 35.7,21.3 v36,21.6 | STM32F405RGT6.52 35.75,40.25 v36,40
  Bottom 0.254: U$5.CS 25.76,18.11 R6.1 27.45,19.8 v27.45,20 | v36,40 v36,21.6
SPI2_MISO
  Top 0.254: STM32F405RGT6.35 24.75,35.35 24.1,34.7 15.8,34.7 14.43,36.07 U$3.MISO
SPI2_MOSI
  Top 0.254: STM32F405RGT6.36 25.25,35.25 24.2,34.2 15.4,34.2 13.3,36.3 13.3,44.6 14,45.3 17.4,45.3 18.2,44.5 18.2,42.91 U$3.MOSI
SPI2_SCK
  Top 0.254: STM32F405RGT6.34 24.25,35.75 23.7,35.2 16.9,35.2 15.5,36.6 15.5,40.61 U$3.SCK
SPI2_SS
  Top 0.254: STM32F405RGT6.33 23.75,36.05 23.4,35.7 17.02,35.7 15.92,36.8 15.92,43.17 U$3.SS
SW  (via drill 0.3)
  Top 0.254: STM32F405RGT6.44 29.25,42.45 v31.05,44.25 STM32F405RGT6.60
  Bottom 0.254: R2.2 U$7.P$1 31.05,48.86 v31.05,44.25
SWCLK
  Top 0.254: STM32F405RGT6.49 34.45,38.75 41.2,32 JP5.3
SWDIO
  Top 0.254: STM32F405RGT6.46 30.25,37.85 30.7,38.3 34.2,38.3 41.5,31 JP5.2
TIM2_CH1  (via drill 0.3)
  Top 0.254: STM32F405RGT6.50 34.65,39.25 35.1,38.8 39.1,38.8 v39.8,38.1 | JP4.2 v13.9,13.6
  Bottom 0.254: v13.9,13.6 33.5,13.6 39.8,19.9 v39.8,38.1
TIM2_CH2  (via drill 0.3)
  Top 0.254: STM32F405RGT6.55 37.35,41.75 v40.4,38.7 | JP4.3 v13.9,12.6
  Bottom 0.254: v13.9,12.6 33.4,12.6 40.4,19.6 v40.4,38.7
TIM3_CH1  (via drill 0.3)
  Top 0.254: JP2.2 48.9,12.4 47.6,13.7 47.6,19.3 v41,25.9 | STM32F405RGT6.56 37.95,42.25 41,39.2 v41,38.1
  Bottom 0.254: v41,38.1 v41,25.9
TIM3_CH2  (via drill 0.3)
  Top 0.254: JP2.3 48.9,13.4 48.1,14.2 48.1,20 v41.6,26.5 | STM32F405RGT6.57 38.55,42.75 41.6,39.7 v41.6,38.7
  Bottom 0.254: v41.6,38.7 v41.6,26.5
TIM4_CH1
  Top 0.254: STM32F405RGT6.58 39.87,43.25 41.3,41.82 49.28,41.82 JP3.2
TIM4_CH2
  Top 0.254: STM32F405RGT6.59 40.05,43.75 41.5,42.3 49.2,42.3 JP3.3
TIM5_CH1
  Top 0.254: STM32F405RGT6.14 24.75,49.95 24.3,50.4 13.9,50.4 6.1,42.6 JP1.2
TIM5_CH2
  Top 0.254: STM32F405RGT6.15 24.25,49.45 23.8,49.9 14.3,49.9 6,41.6 JP1.3
TIM8_CH1
  Top 0.254: STM32F405RGT6.37 25.75,35.15 24.3,33.7 21.6,33.7 12.1,24.2 JP7.2
TIM8_CH2
  Top 0.254: STM32F405RGT6.38 26.25,34.95 24.5,33.2 21.8,33.2 11.8,23.2 JP7.3
TIM11_CH1  (via drill 0.3)
  Top 0.254: STM32F405RGT6.62 40.75,45.25 v41.7,44.3
  Bottom 0.254: U$14.1 45.35,35.85 44.9,36.3 44.9,41.4 44,42.3 43.1,42.3 41.7,43.7 v41.7,44.3
TIM12_CH1  (via drill 0.3)
  Top 0.254: STM32F405RGT6.61 40.05,44.75 v40.5,44.3
  Bottom 0.254: U$11.1 45.65,17.25 44.4,18.5 44.4,28.6 42.3,30.7 42.3,40.2 40.5,42 v40.5,44.3
TIM13_CH1  (via drill 0.3)
  Top 0.254: STM32F405RGT6.22 20.15,43.75 18.2,45.7 18.2,47.1 17.3,48 14.2,48 9.1,42.9 v9.1,41.7
  Bottom 0.254: v9.1,41.7 U$12.1
TIM14_CH1  (via drill 0.3)
  Top 0.254: STM32F405RGT6.23 20.05,43.25 17.58,45.72 13.22,45.72 10.8,43.3 v10.8,25.3
  Bottom 0.254: v10.8,25.3 10.8,21.55 U$13.1
USART1_RX
  Top 0.254: STM32F405RGT6.43 28.75,35.35 30.4,33.7 36.7,33.7 41,29.4 44.2,29.4 48,25.6 48,24.7 48.7,24 JP6.3
USART1_TX
  Top 0.254: STM32F405RGT6.42 28.25,35.15 30.2,33.2 36.6,33.2 40.9,28.9 44,28.9 47.5,25.4 47.5,24.5 49,23 JP6.2
USART2_RX  (via drill 0.3)
  Top 0.254: STM32F405RGT6.17 21.9,47.9 20.9,48.9 14.5,48.9 8.1,42.5 v8.1,25.3 | v8.1,22.3 21.1,9.3 U$1.TX0
  Bottom 0.254: v8.1,25.3 v8.1,22.3
USART2_TX  (via drill 0.3)
  Top 0.254: v7.2,25.3 7.2,41.4 7.2,41.7 7.2,42.2 14.4,49.4 23.4,49.4 23.75,49.05 STM32F405RGT6.16 | v7.2,22.3 23.2,6.3 U$1.RX0
  Bottom 0.254: v7.2,25.3 v7.2,22.3
VBAT  (via drill 0.3)
  Top 0.406: U$4.PLUS 15.23,5.17 C17.1 17.4,8.7 v18.4,9.7 | v20.4,11.7 21,12.3 U$1.VBAC
  Bottom 0.406: v18.4,9.7 v20.4,11.7
VCC  (via drill 0.3)
  Top 0.61: JP7.4 v3.7,22.2 | JP1.4 4.7,40.6 3.9,39.8 3.9,38.67 JP8.1 | JP4.4 4,11.6 v3.2,12.4 | JP2.4 51.2,14.4 v51.25,14.45 | JP6.4 v52.77,25 | JP5.4 v52.77,33 | JP3.4 51.4,43.6 v52.1,42.9
  Bottom 0.254: R3.2 11.9,33.5 11.8,33.4
  Bottom 0.61: v3.2,12.4 2.22,13.38 C20.1 | v52.1,42.9 52.38,42.62 C21.1
  Bottom 1.016: C19.1 2.62,37.4 JP8.1 2.23,36.17 5.75,32.65 CN1.1 3.7,26.75 v3.7,22.2 3.7,20.6 1.83,18.73 JP9.1 2.22,18 C20.1 | C21.1 52.38,37.2 JP10.1 v52.77,33 v52.77,25 JP11.1 52.38,17.8 C18.1 52.38,15.57 v51.25,14.45 45,8.2 14,8.2 12.1,10.1 12.1,28.5 13,29.4 13,31.9
  pour Bottom (no thermals): 8.5,33.8 14.6,33.8 14.6,31.5 8.5,31.5
VOUT  (via drill 0.3)
  Top 0.254: v17.5,40.5 19.25,42.25 STM32F405RGT6.25
  Bottom 0.254: v17.5,40.5 12.85,40.5 R4.2 R3.1

### Text on the board
tNames: Res | Sw | Enc1 | Enc4 | SWD | Enc5 | USART | Enc2 | Enc3 | V2.0